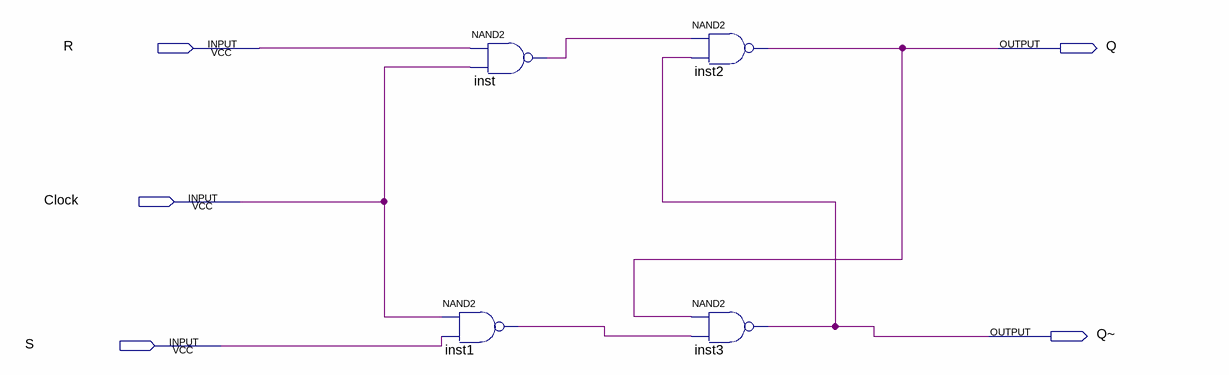
[diagram p0: schematic sheet]
// Quartus schematic OppositeSR.bdf as structural Verilog: 4 symbols, 5 pins
module OppositeSR (
  input  R,
  input  Clock,
  input  S,
  output Q,
  output \Q~ 
);

  wire inst1_out, inst_out;

  nand inst1 (inst1_out, Clock, S);
  nand inst (inst_out, R, Clock);
  nand inst2 (Q, inst_out, \Q~ );
  nand inst3 (\Q~ , Q, inst1_out);
endmodule
